# Altium schematic sheet Connectors.SchDoc
size A; SheetNumber: 2; SheetTotal: 5
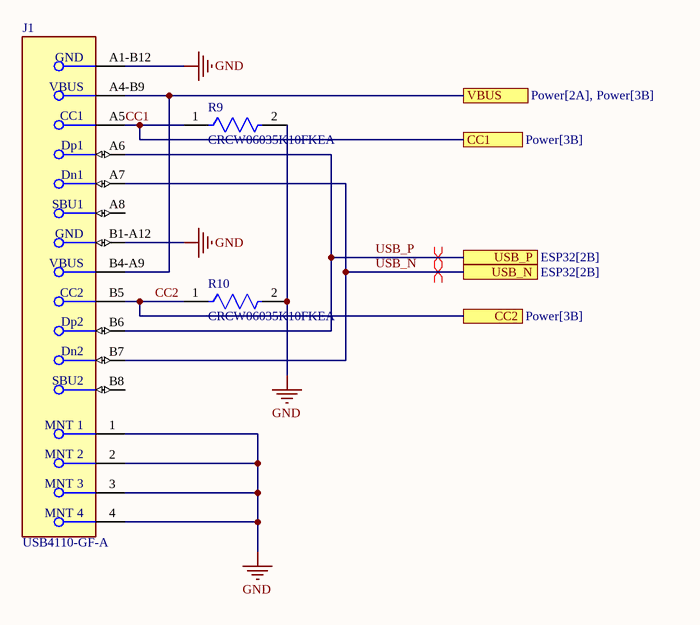
[diagram p0: Connectors.SchDoc]

## Parts
J1  USB4110-GF-A  [FP-USB4110-GF-A-MFG]
R9  CRCW06035K10FKEA  [FP-CRCW0603-e3-IPC_C]
R10  CRCW06035K10FKEA  [FP-CRCW0603-e3-IPC_C]

## Ports
CC1 (see Power[3B]), CC2 (see Power[3B]), USB_N (see ESP32[2B]), USB_P (see ESP32[2B]), VBUS (see Power[2A], Power[3B])

## Nets
GND: J1.1(MNT_1) J1.2(MNT_2) J1.3(MNT_3) J1.4(MNT_4) J1.A1-B12(GND) J1.B1-A12(GND) R9.2 R10.2
CC1: J1.A5(CC1) R9.1 ; port CC1
CC2: J1.B5(CC2) R10.1 ; port CC2
USB_N: J1.A7(Dn1) J1.B7(Dn2) ; port USB_N
USB_P: J1.A6(Dp1) J1.B6(Dp2) ; port USB_P
VBUS: J1.A4-B9(VBUS) J1.B4-A9(VBUS) ; port VBUS

Not connected (* = marked no-connect by the designer): J1 A8(SBU1) B8(SBU2)

## Layout directives
differential pair: USB_N, USB_P

## Library data of the parts
J1 = CMP-245163-000002-1: CONN USB 2.0 TYPE-C R/A SMT; Manufacturer: GCT; Conn Orientation: Right Angle; Usb Standard: USB 2.0; Voltage Rating: 20V; Current Rating: 3/4.25/1.25/0.25A; Number Of Contacts: 16; Is Female: yes; Shielding: true; Standoff Height: 0.1mm; Octopart: https://octopart.com/usb4110-gf-a-gct-103941985; Temperature: -40°C to +85°C; RoHS: TRUE; Automotive: No; Contact Material: Gold,Nickel; Device Class L1: Connectors; Device Class L2: USB Connectors; Package: 0; Lead Free: Yes; ComponentLink2URL: https://gct.co/files/drawings/usb4110.pdf; Temperature Range High: +85°C; Temperature Range Low: -40°C; Height: 3.46mm; Manufacturer Part Number: USB4110-GF-A; ComponentLink2Description: Datasheet; Device Class L3: unset; Digikey Description: CONN USB 2.0 TYPE-C R/A SMT; Category: Conn
R9 R10 = CMP-1012-00590-3: RES Thick Film, 5.1kΩ, 1%, 0.1W, 100ppm/°C, 0603; Power Rating: 100mW; Voltage Rating (DC): 75V; Resistance: 5.1kR; Width: 0.85mm; Depth: 0.85mm; Military Standard: Not; Package Quantity: 5000; Case Code (Metric): 1608; Length: 1.55mm; Weight: 7.1E-05oz; Packaging: Tape and Reel; Temperature Coefficient: 100ppm/°C; Case Code (Imperial): 0603; Lead Free: Lead Free; Radiation Hardening: No; Contact Plating: Tin; Composition: Thick Film; Max Operating Temperature: 155°C; Termination: SMD/SMT; Case/Package: 0603; Min Operating Temperature: -55°C; Tolerance: 1%; Voltage Rating: 75V; Mount: Surface Mount; Height: 0.45mm